# Altium schematic sheet Unused_SODIMM.SchDoc: Dahlia Carrier Board
size A3; Organization: Toradex AG; Address1: Ebenaustrasse 10; Address2: Horw; Address3: 6048; Address4: Switzerland; DocumentNumber: 21; Revision: V1.1; SheetNumber: 21; SheetTotal: 21; PageSetup: Record=PageOptions|CenterHorizontal=True|CenterVertical=True|PrintScale=0.71|XCorrection=1.00|YCorrection=1.00|PrintKind=1|BorderSize=5000000|LeftOffset=0|BottomOffset=0|Orientation=2|PaperLength=1000|PaperWidth=1000|Scale=100|PaperSource=15|PrintQuality=600|MediaType=1|DitherType=10|PaperKind=A4|PrintScaleMode=1
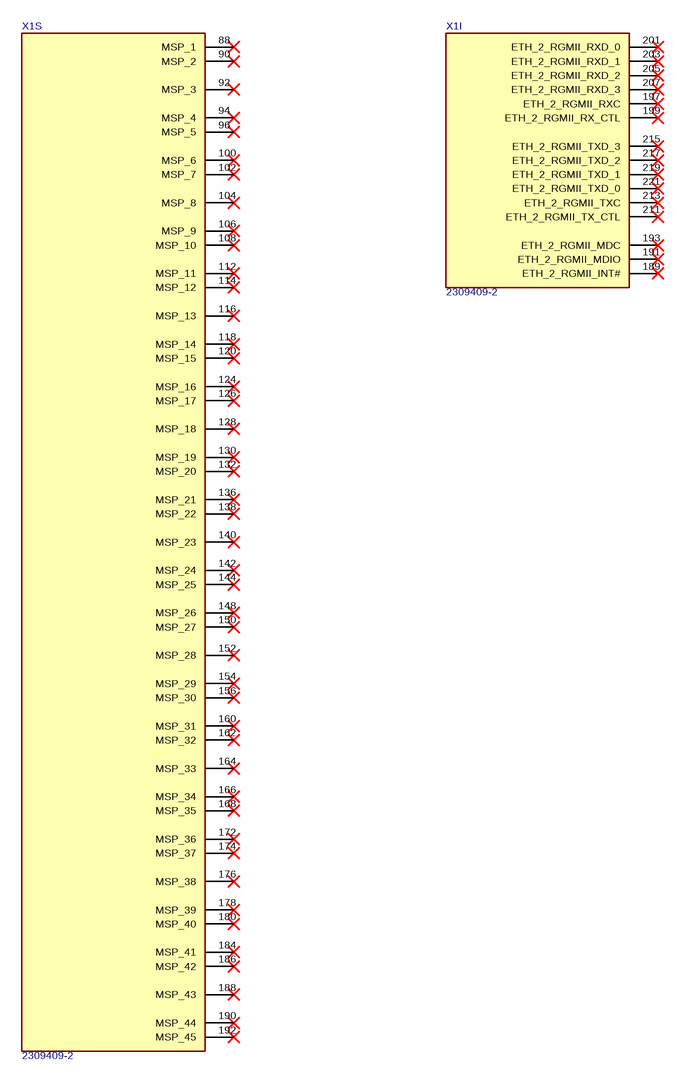
[diagram p0: Unused_SODIMM.SchDoc]

## Parts
X1  2309409-2  [CON-TE-2309409-2-SOLDERABLE-STANDOFFS]  (parts I,S of 23)

## Nets

Not connected (* = marked no-connect by the designer): X1 88(MSP_1)* 90(MSP_2)* 92(MSP_3)* 94(MSP_4)* 96(MSP_5)* 100(MSP_6)* 102(MSP_7)* 104(MSP_8)* 106(MSP_9)* 108(MSP_10)* 112(MSP_11)* 114(MSP_12)* 116(MSP_13)* 118(MSP_14)* 120(MSP_15)* 124(MSP_16)* 126(MSP_17)* 128(MSP_18)* 130(MSP_19)* 132(MSP_20)* 136(MSP_21)* 138(MSP_22)* 140(MSP_23)* 142(MSP_24)* 144(MSP_25)* 148(MSP_26)* 150(MSP_27)* 152(MSP_28)* 154(MSP_29)* 156(MSP_30)* 160(MSP_31)* 162(MSP_32)* 164(MSP_33)* 166(MSP_34)* 168(MSP_35)* 172(MSP_36)* 174(MSP_37)* 176(MSP_38)* 178(MSP_39)* 180(MSP_40)* 184(MSP_41)* 186(MSP_42)* 188(MSP_43)* 189(ETH_2_RGMII_INT#)* 190(MSP_44)* 191(ETH_2_RGMII_MDIO)* 192(MSP_45)* 193(ETH_2_RGMII_MDC)* 197(ETH_2_RGMII_RXC)* 199(ETH_2_RGMII_RX_CTL)* 201(ETH_2_RGMII_RXD_0)* 203(ETH_2_RGMII_RXD_1)* 205(ETH_2_RGMII_RXD_2)* 207(ETH_2_RGMII_RXD_3)* 211(ETH_2_RGMII_TX_CTL)* 213(ETH_2_RGMII_TXC)* 215(ETH_2_RGMII_TXD_3)* 217(ETH_2_RGMII_TXD_2)* 219(ETH_2_RGMII_TXD_1)* 221(ETH_2_RGMII_TXD_0)*

## Notes on the sheet
- Title
- Size:
- Date:
- A3
- Number:
- Time:
- Revision:
- Sheet
- of
- File:

## Library data of the parts
X1 = CON-TE-2309409-2: DDR4 SODIMM Socket, 260 pins, 5.2mm(H), 0.5mm Pitch; Manufacturer Name: TE; Temperature Range: -40C to +125C; Package: DDR4-SODIMM-260; Manufacturer Part No.: 2309409-2